# Altium schematic sheet PartC.SchDoc
size A4
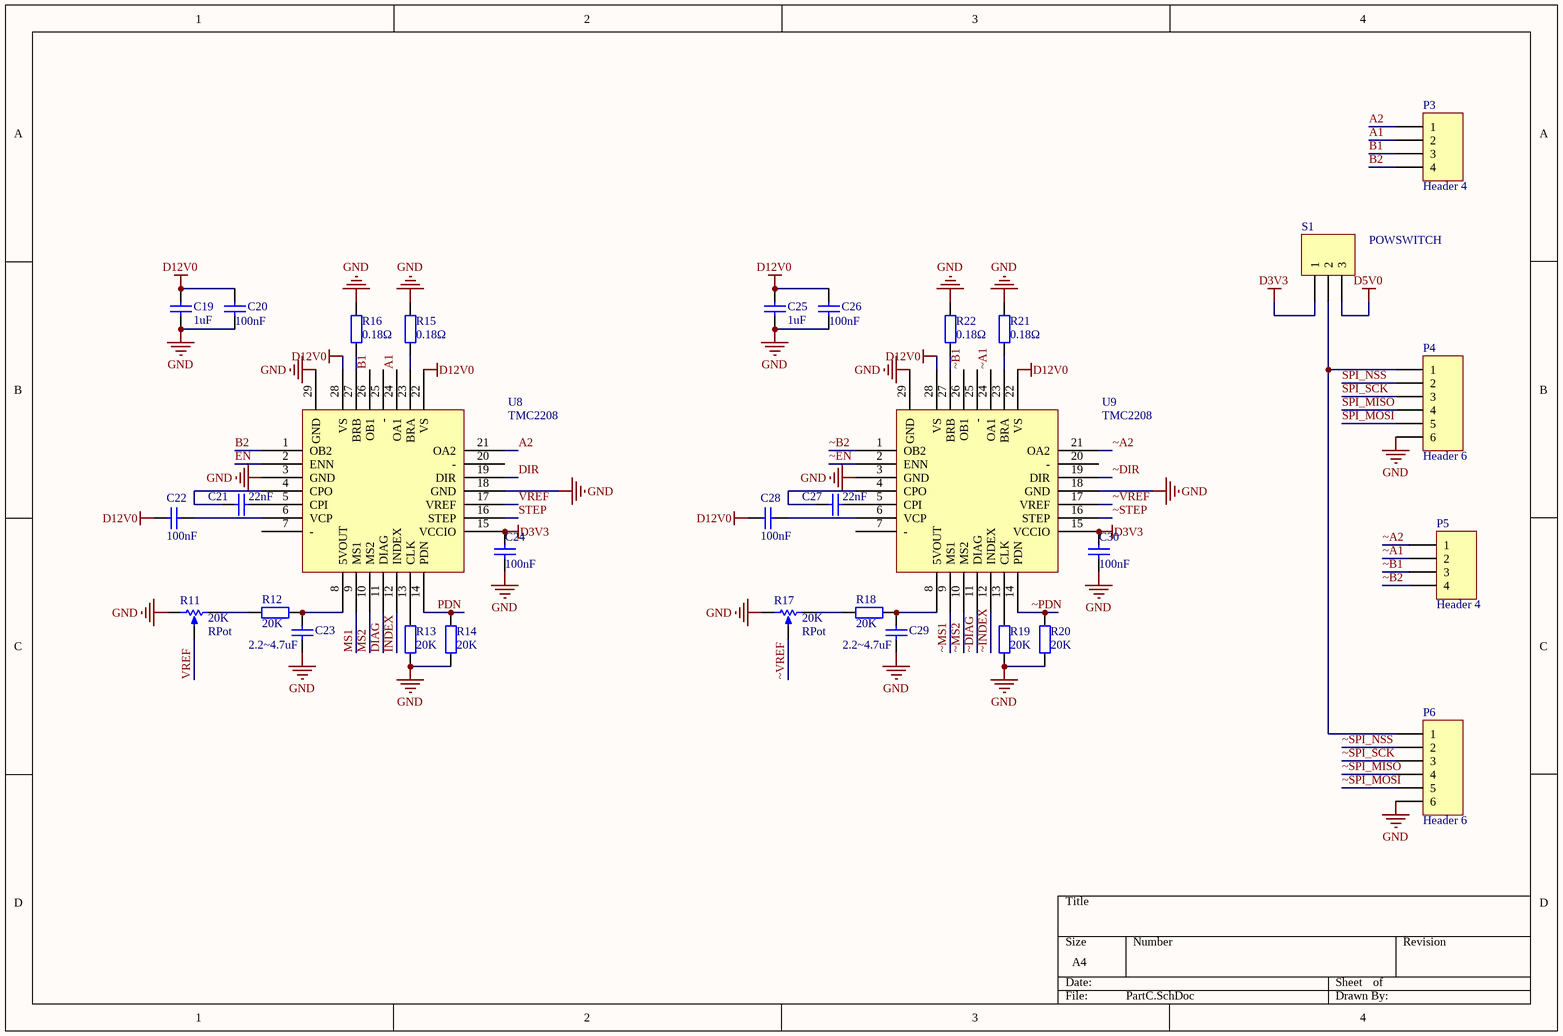
[diagram p0: PartC.SchDoc]

## Parts
C19  1uF  [1206C]
C20  100nF  [0603C]
C21  22nF  [0603C]
C22  100nF  [0603C]
C23  2.2~4.7uF  [0603C]
C24  100nF  [0603C]
C25  1uF  [1206C]
C26  100nF  [0603C]
C27  22nF  [0603C]
C28  100nF  [0603C]
C29  2.2~4.7uF  [0603C]
C30  100nF  [0603C]
P3  Header 4  [XH_4_V]
P4  Header 6  [XH_6_V]
P5  Header 4  [XH_4_V]
P6  Header 6  [XH_6_V]
R11  RPot  value 20K  [VR_SMD]
R12  20K  [0603R]
R13  20K  [0603R]
R14  20K  [0603R]
R15  0.18Ω  [1206R]
R16  0.18Ω  [1206R]
R17  RPot  value 20K  [VR_SMD]
R18  20K  [0603R]
R19  20K  [0603R]
R20  20K  [0603R]
R21  0.18Ω  [1206R]
R22  0.18Ω  [1206R]
S1  POWSWITCH  [HDR1X3]
U8  TMC2208  [QFN28 5x5_M]
U9  TMC2208  [QFN28 5x5_M]

## Nets
D3V3: C24.2 C30.2 S1.1 U8.15(VCCIO) U9.15(VCCIO)
D5V0: S1.3
D12V0: C19.1 C20.2 C22.2 C25.1 C26.2 C28.2 U8.22(VS) U8.28(VS) U9.22(VS) U9.28(VS)
GND: C19.2 C20.1 C23.1 C24.1 C25.2 C26.1 C29.1 C30.1 P4.6 P6.6 R11.1(TOP) R13.1 R14.1 R15.1 R16.1 R17.1(TOP) R19.1 R20.1 R21.1 R22.1 U8.3(GND) U8.18(GND) U8.29(GND) U9.3(GND) U9.18(GND) U9.29(GND)
A1: P3.2 U8.24(OA1)
A2: P3.1 U8.21(OA2)
B1: P3.3 U8.26(OB1)
B2: P3.4 U8.1(OB2)
DIAG: U8.11(DIAG)
DIR: U8.19(DIR)
EN: U8.2(ENN)
INDEX: U8.12(INDEX)
MS1: U8.9(MS1)
MS2: U8.10(MS2)
PDN: R14.2 U8.14(PDN)
SPI_MISO: P4.4
SPI_MOSI: P4.5
SPI_NSS: P4.2
SPI_SCK: P4.3
STEP: U8.16(STEP)
VREF: R11.3(TAP) U8.17(VREF)
~A1: P5.2 U9.24(OA1)
~A2: P5.1 U9.21(OA2)
~B1: P5.3 U9.26(OB1)
~B2: P5.4 U9.1(OB2)
~DIAG: U9.11(DIAG)
~DIR: U9.19(DIR)
~EN: U9.2(ENN)
~INDEX: U9.12(INDEX)
~MS1: U9.9(MS1)
~MS2: U9.10(MS2)
~PDN: R20.2 U9.14(PDN)
~SPI_MISO: P6.4
~SPI_MOSI: P6.5
~SPI_NSS: P6.2
~SPI_SCK: P6.3
~STEP: U9.16(STEP)
~VREF: R17.3(TAP) U9.17(VREF)
NetC21_1: C21.1 U8.5(CPI)
NetC21_2: C21.2 U8.4(CPO)
NetC22_1: C22.1 U8.6(VCP)
NetC23_2: C23.2 R12.1 U8.8(5VOUT)
NetC27_1: C27.1 U9.5(CPI)
NetC27_2: C27.2 U9.4(CPO)
NetC28_1: C28.1 U9.6(VCP)
NetC29_2: C29.2 R18.1 U9.8(5VOUT)
NetP4_1: P4.1 P6.1 S1.2
NetR11_2: R11.2(BOT) R12.2
NetR13_2: R13.2 U8.13(CLK)
NetR15_2: R15.2 U8.23(BRA)
NetR16_2: R16.2 U8.27(BRB)
NetR17_2: R17.2(BOT) R18.2
NetR19_2: R19.2 U9.13(CLK)
NetR21_2: R21.2 U9.23(BRA)
NetR22_2: R22.2 U9.27(BRB)

Not connected (* = marked no-connect by the designer): U8 7(-) 20(-) 25(-); U9 7(-) 20(-) 25(-)

## Library data of the parts
C19-C30 = Cap: Capacitor; Published: 8-Jun-2000; LatestRevisionDate: 17-Jul-2002; LatestRevisionNote: Re-released for DXP Platform.; PackageReference: RAD-0.3; Publisher: Altium Limited
  C19 C25: Value: 1uF
  C20 C22 C24 C26 C28 C30: Value: 100nF
  C21 C27: Value: 22nF
  C23 C29: Value: 2.2~4.7uF
P3 P5 = Header 4: Header, 4-Pin; LatestRevisionDate: 17-Jul-2002; LatestRevisionNote: Re-released for DXP Platform.; Publisher: Altium Limited
P4 P6 = Header 6: Header, 6-Pin; LatestRevisionDate: 17-Jul-2002; LatestRevisionNote: Re-released for DXP Platform.; Publisher: Altium Limited
R11 R17 = RPot: Potentiometer; Sim Note: Enter the Resistance value and the set point into parameter fields.; Set Position: 0.5; Published: 8-Jun-2000; LatestRevisionDate: 17-Jul-2002; LatestRevisionNote: Re-released for DXP Platform.; PackageReference: VR5; Publisher: Altium Limited; PackageDescription: Variable Resistor, Thru-Hole; 3 Leads
R12-R16 R18-R22 = RES: Resistor; Value: 1K; Published: 8-Jun-2000; Revision: July-2002: Re-released for DXP Platform.; Publisher: Altium Limited
S1 = Header 3H: Header, 3-Pin, Right Angle; LatestRevisionDate: 17-Jul-2002; LatestRevisionNote: Re-released for DXP Platform.; Publisher: Altium Limited